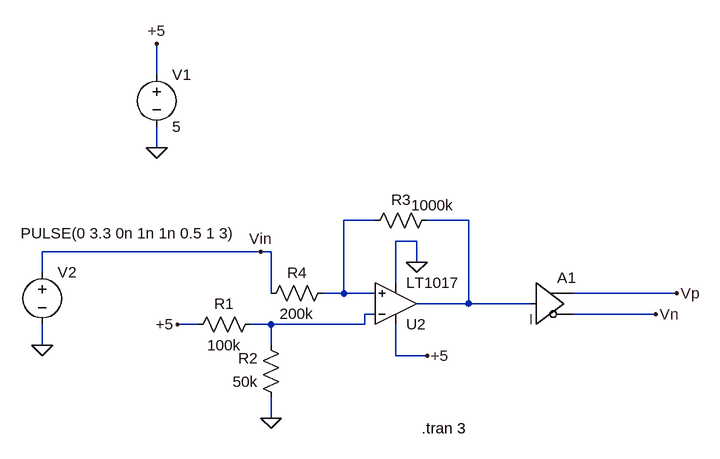
[diagram p0: schematic Draft5.asc]
Draft5.asc, the LTspice schematic file:
Version 4.1
SHEET 1 1520 680
WIRE -368 -224 -368 -272
WIRE -368 -112 -368 -144
WIRE -32 0 -80 0
WIRE 112 0 48 0
WIRE 32 32 0 32
WIRE -208 48 -544 48
WIRE -192 48 -208 48
WIRE 32 64 32 32
WIRE -544 80 -544 48
WIRE 0 96 0 32
WIRE -192 112 -192 48
WIRE -80 112 -80 0
WIRE -80 112 -112 112
WIRE -32 112 -80 112
WIRE 432 112 272 112
WIRE 112 128 112 0
WIRE 112 128 32 128
WIRE 208 128 112 128
WIRE -32 144 -48 144
WIRE 400 144 272 144
WIRE -304 160 -336 160
WIRE -192 160 -224 160
WIRE -48 160 -48 144
WIRE -48 160 -192 160
WIRE -544 192 -544 160
WIRE -192 192 -192 160
WIRE 0 208 0 160
WIRE 48 208 0 208
WIRE -192 304 -192 272
FLAG -368 -112 0
FLAG -368 -272 +5
FLAG 48 208 +5
FLAG 32 64 0
FLAG -336 160 +5
FLAG -192 304 0
FLAG -544 192 0
FLAG -208 48 Vin
FLAG 432 112 Vp
FLAG 400 144 Vn
SYMBOL voltage -368 -240 R0
WINDOW 123 0 0 Left 0
WINDOW 39 0 0 Left 0
SYMATTR InstName V1
SYMATTR Value 5
SYMBOL res -208 144 R90
WINDOW 0 0 56 VBottom 2
WINDOW 3 32 56 VTop 2
SYMATTR InstName R1
SYMATTR Value 100k
SYMBOL res -176 288 R180
WINDOW 0 36 76 Left 2
WINDOW 3 36 40 Left 2
SYMATTR InstName R2
SYMATTR Value 50k
SYMBOL voltage -544 64 R0
WINDOW 3 -33 -44 Left 2
WINDOW 123 0 0 Left 0
WINDOW 39 0 0 Left 0
SYMATTR Value PULSE(0 3.3 0n 1n 1n 0.5 1 3)
SYMATTR InstName V2
SYMBOL Comparators\\LT1017 0 128 M180
SYMATTR InstName U2
SYMBOL res 64 -16 R90
WINDOW 0 0 56 VBottom 2
WINDOW 3 -23 7 VTop 2
SYMATTR InstName R3
SYMATTR Value 1000k
SYMBOL res -96 96 R90
WINDOW 0 0 56 VBottom 2
WINDOW 3 32 56 VTop 2
SYMATTR InstName R4
SYMATTR Value 200k
SYMBOL Digital\\buf 208 64 R0
SYMATTR InstName A1
SYMATTR SpiceLine Vhigh=5
TEXT 40 320 Left 2 !.tran 3

The netlist it stands for:
* Draft5.asc
V1 +5 0 5
R1 N003 +5 100k
R2 0 N003 50k
V2 Vin 0 PULSE(0 3.3 0n 1n 1n 0.5 1 3)
X§U2 N001 N003 +5 0 N002 LT1017  ; pins In+ In- V+ V- OUT
R3 N002 N001 1000k
R4 N001 Vin 200k
A1 N002 0 0 0 0 Vn Vp 0 BUF Vhigh=5
.tran 3
.backanno
.end